# EAGLE schematic Power Cond 2 (EAGLE 7.2.0)
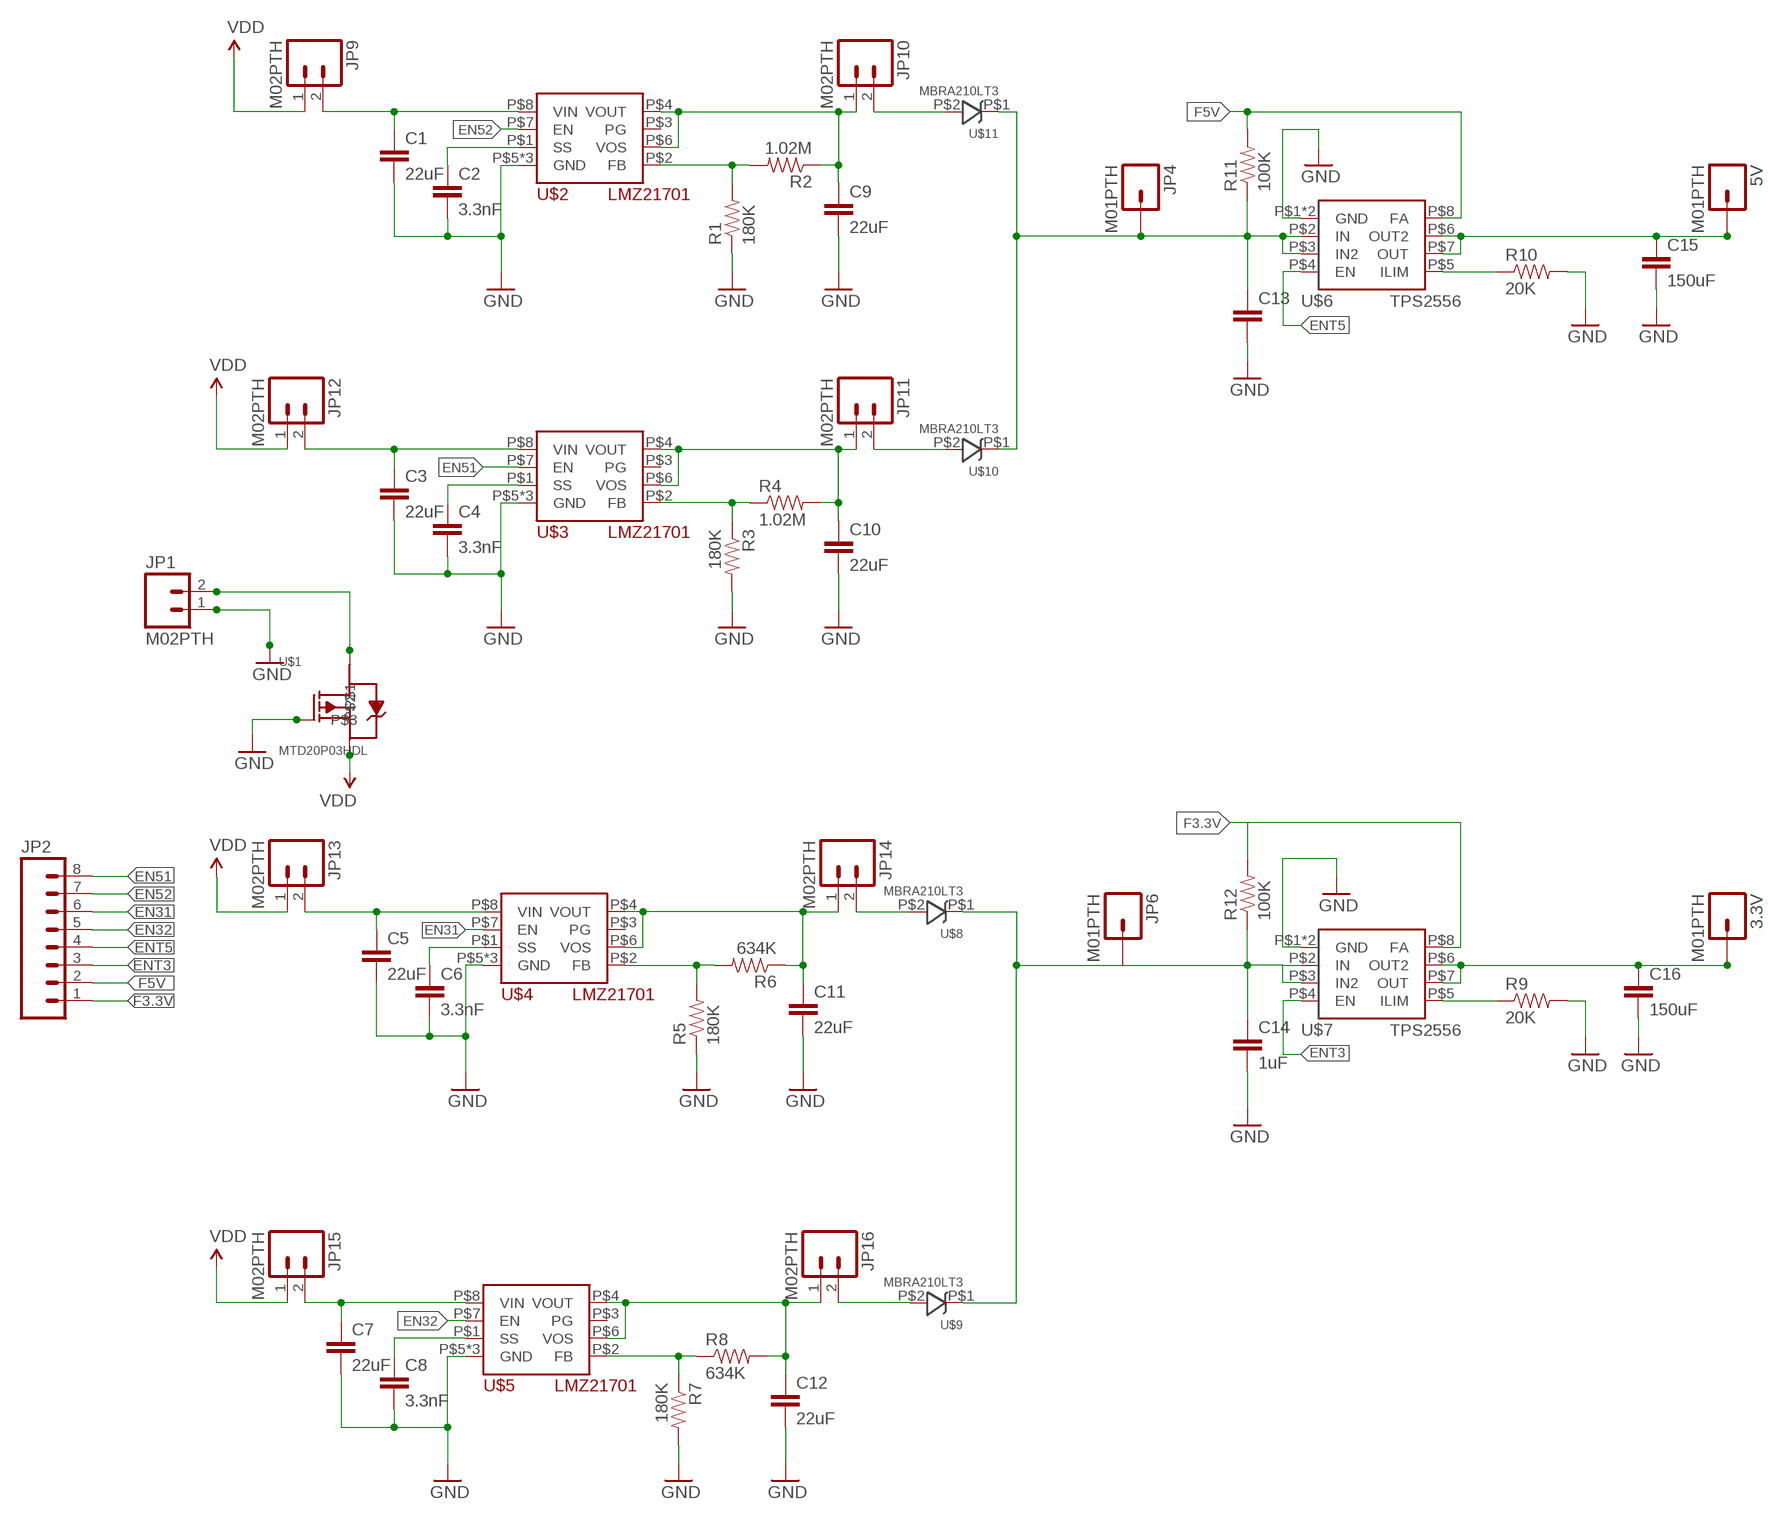
[diagram p0: schematic, sheet 1]

## Parts
3.3V  M01PTH  [1X01]
5V  M01PTH  [1X01]
C1  22uF  CAP0603-CAP  [0603-CAP]
C2  3.3nF  CAP0603-CAP  [0603-CAP]
C3  22uF  CAP0603-CAP  [0603-CAP]
C4  3.3nF  CAP0603-CAP  [0603-CAP]
C5  22uF  CAP0603-CAP  [0603-CAP]
C6  3.3nF  CAP0603-CAP  [0603-CAP]
C7  22uF  CAP0603-CAP  [0603-CAP]
C8  3.3nF  CAP0603-CAP  [0603-CAP]
C9  22uF  CAP0603-CAP  [0603-CAP]
C10  22uF  CAP0603-CAP  [0603-CAP]
C11  22uF  CAP0603-CAP  [0603-CAP]
C12  22uF  CAP0603-CAP  [0603-CAP]
C13  CAP0603-CAP  [0603-CAP]
C14  1uF  CAP0603-CAP  [0603-CAP]
C15  150uF  CAP1206  [1206]
C16  150uF  CAP1206  [1206]
JP1  M02PTH  [1X02]
JP2  M08  [1X08_ROUND]
JP4  M01PTH  [1X01]
JP6  M01PTH  [1X01]
JP9  M02PTH  [1X02]
JP10  M02PTH  [1X02]
JP11  M02PTH  [1X02]
JP12  M02PTH  [1X02]
JP13  M02PTH  [1X02]
JP14  M02PTH  [1X02]
JP15  M02PTH  [1X02]
JP16  M02PTH  [1X02]
R1  180K  RESISTOR0603-RES  [0603-RES]
R2  1.02M  RESISTOR0603-RES  [0603-RES]
R3  180K  RESISTOR0603-RES  [0603-RES]
R4  1.02M  RESISTOR0603-RES  [0603-RES]
R5  180K  RESISTOR0603-RES  [0603-RES]
R6  634K  RESISTOR0603-RES  [0603-RES]
R7  180K  RESISTOR0603-RES  [0603-RES]
R8  634K  RESISTOR0603-RES  [0603-RES]
R9  20K  RESISTOR0603-RES  [0603-RES]
R10  20K  RESISTOR0603-RES  [0603-RES]
R11  100K  RESISTOR0603-RES  [0603-RES]
R12  100K  RESISTOR0603-RES  [0603-RES]
U$1  MTD20P03HDL  [DPAK_369C_SMD]
U$2  LMZ21701  [LMZ21701]
U$3  LMZ21701  [LMZ21701]
U$4  LMZ21701  [LMZ21701]
U$5  LMZ21701  [LMZ21701]
U$6  TPS2556  [TPS2556]
U$7  TPS2556  [TPS2556]
U$8  MBRA210LT3  [DO-214AC-SMA]
U$9  MBRA210LT3  [DO-214AC-SMA]
U$10  MBRA210LT3  [DO-214AC-SMA]
U$11  MBRA210LT3  [DO-214AC-SMA]

## Nets
EN31: C5.1 JP2.6 JP13.2 U$4.P$7(EN) U$4.P$8(VIN)
EN32: JP2.5 U$5.P$7(EN)
EN51: JP2.8 U$3.P$7(EN)
EN52: JP2.7 U$2.P$7(EN)
ENT3: JP2.3 U$7.P$4(EN)
ENT5: JP2.4 U$6.P$4(EN)
F3.3V: JP2.1 R12.2 U$7.P$8(FA)
F5V: JP2.2 R11.2 U$6.P$8(FA)
GND: C1.2 C2.2 C3.2 C4.2 C5.2 C6.2 C7.2 C8.2 C9.2 C10.2 C11.2 C12.2 C13.2 C14.2 C15.2 C16.2 JP1.1 R1.1 R3.2 R5.1 R7.2 R9.2 R10.2 U$1.P$3 U$2.P$5(GND) U$2.P$9(GND) U$2.P$10(GND) U$3.P$5(GND) U$3.P$9(GND) U$3.P$10(GND) U$4.P$5(GND) U$4.P$9(GND) U$4.P$10(GND) U$5.P$5(GND) U$5.P$9(GND) U$5.P$10(GND) U$6.P$1(GND) U$6.P$9(GND) U$7.P$1(GND) U$7.P$9(GND)
N$1: JP1.2
N$2: R10.1 U$6.P$5(ILIM)
N$3: R9.1 U$7.P$5(ILIM)
N$4: U$1.P$2
N$5: 5V.1 C15.1 U$6.P$6(OUT2) U$6.P$7(OUT)
N$6: C13.1 JP4.1 R11.1 U$6.P$2(IN) U$6.P$3(IN2) U$10.P$1 U$11.P$1
N$7: C6.1 U$4.P$1(SS)
N$8: 3.3V.1 C16.1 U$7.P$6(OUT2) U$7.P$7(OUT)
N$10: C14.1 R12.1 U$7.P$2(IN) U$7.P$3(IN2) U$8.P$1 U$9.P$1
N$12: R5.2 R6.2 U$4.P$2(FB)
N$13: JP14.2 U$8.P$2
N$14: C11.1 JP14.1 R6.1 U$4.P$4(VOUT) U$4.P$6(VOS)
N$15: C10.1 JP11.1 R4.2 U$3.P$4(VOUT) U$3.P$6(VOS)
N$16: JP11.2 U$10.P$2
N$17: R3.1 R4.1 U$3.P$2(FB)
N$18: JP10.2 U$11.P$2
N$21: C4.1 U$3.P$1(SS)
N$22: C3.1 JP12.2 U$3.P$8(VIN)
N$24: C9.1 JP10.1 R2.1 U$2.P$4(VOUT) U$2.P$6(VOS)
N$25: R1.2 R2.2 U$2.P$2(FB)
N$32: JP16.2 U$9.P$2
N$33: C12.1 JP16.1 R8.2 U$5.P$4(VOUT) U$5.P$6(VOS)
N$34: R7.1 R8.1 U$5.P$2(FB)
N$36: C7.1 JP15.2 U$5.P$8(VIN)
N$38: C8.1 U$5.P$1(SS)
N$42: C1.1 JP9.2 U$2.P$8(VIN)
N$45: C2.1 U$2.P$1(SS)
VDD: JP9.1 JP12.1 JP13.1 JP15.1
Unconnected: JP6.1 U$1.P$1 U$2.P$3(PG) U$3.P$3(PG) U$4.P$3(PG) U$5.P$3(PG)

## Library data of the parts
3.3V 5V JP4 JP6 = SparkFun-Connectors:M01: Header 1 Standard 1-pin 0.1" header. Use with straight break away headers (SKU : PRT-00116), right angle break away headers (PRT-00553), swiss pins (PRT-00743), machine pins (PRT-00117), and female headers (PRT-00115).
C1-C16 = SparkFun-Capacitors:CAP: Capacitor Standard 0603 ceramic capacitor, and 0.1" leaded capacitor.
JP1 JP9-JP16 = SparkFun-Connectors:M02: Standard 2-pin 0.1" header. Use with - straight break away headers ( PRT-00116) - right angle break away headers (PRT-00553) - swiss pins (PRT-00743) - machine pins (PRT-00117) - female headers (PRT-00115) Molex polarized connector foot print use with: PRT-08233 with associated crimp pins and housings. 2.54_SCREWTERM for use with PRT-10571. 3.5mm Screw Terminal footprints for PRT-08084 5mm Screw Terminal footprints for use with PRT-08432
JP2 = SparkFun-Connectors:M08: Header 8 Standard 8-pin 0.1" header. Use with straight break away headers (SKU : PRT-00116), right angle break away headers (PRT-00553), swiss pins (PRT-00743), machine pins (PRT-00117), and female headers (PRT-00115).
R1-R12 = SparkFun-Passives:RESISTOR: Resistor Basic schematic elements and footprints for 0603, 1206, and PTH resistors.
U$1 = RitLaunchInitiative:MTD20P03HDL
U$2-U$5 = RitLaunchInitiative:LMZ21701
U$6 U$7 = RitLaunchInitiative:TPS2556
U$8-U$11 = RitLaunchInitiative:MBRA210LT3